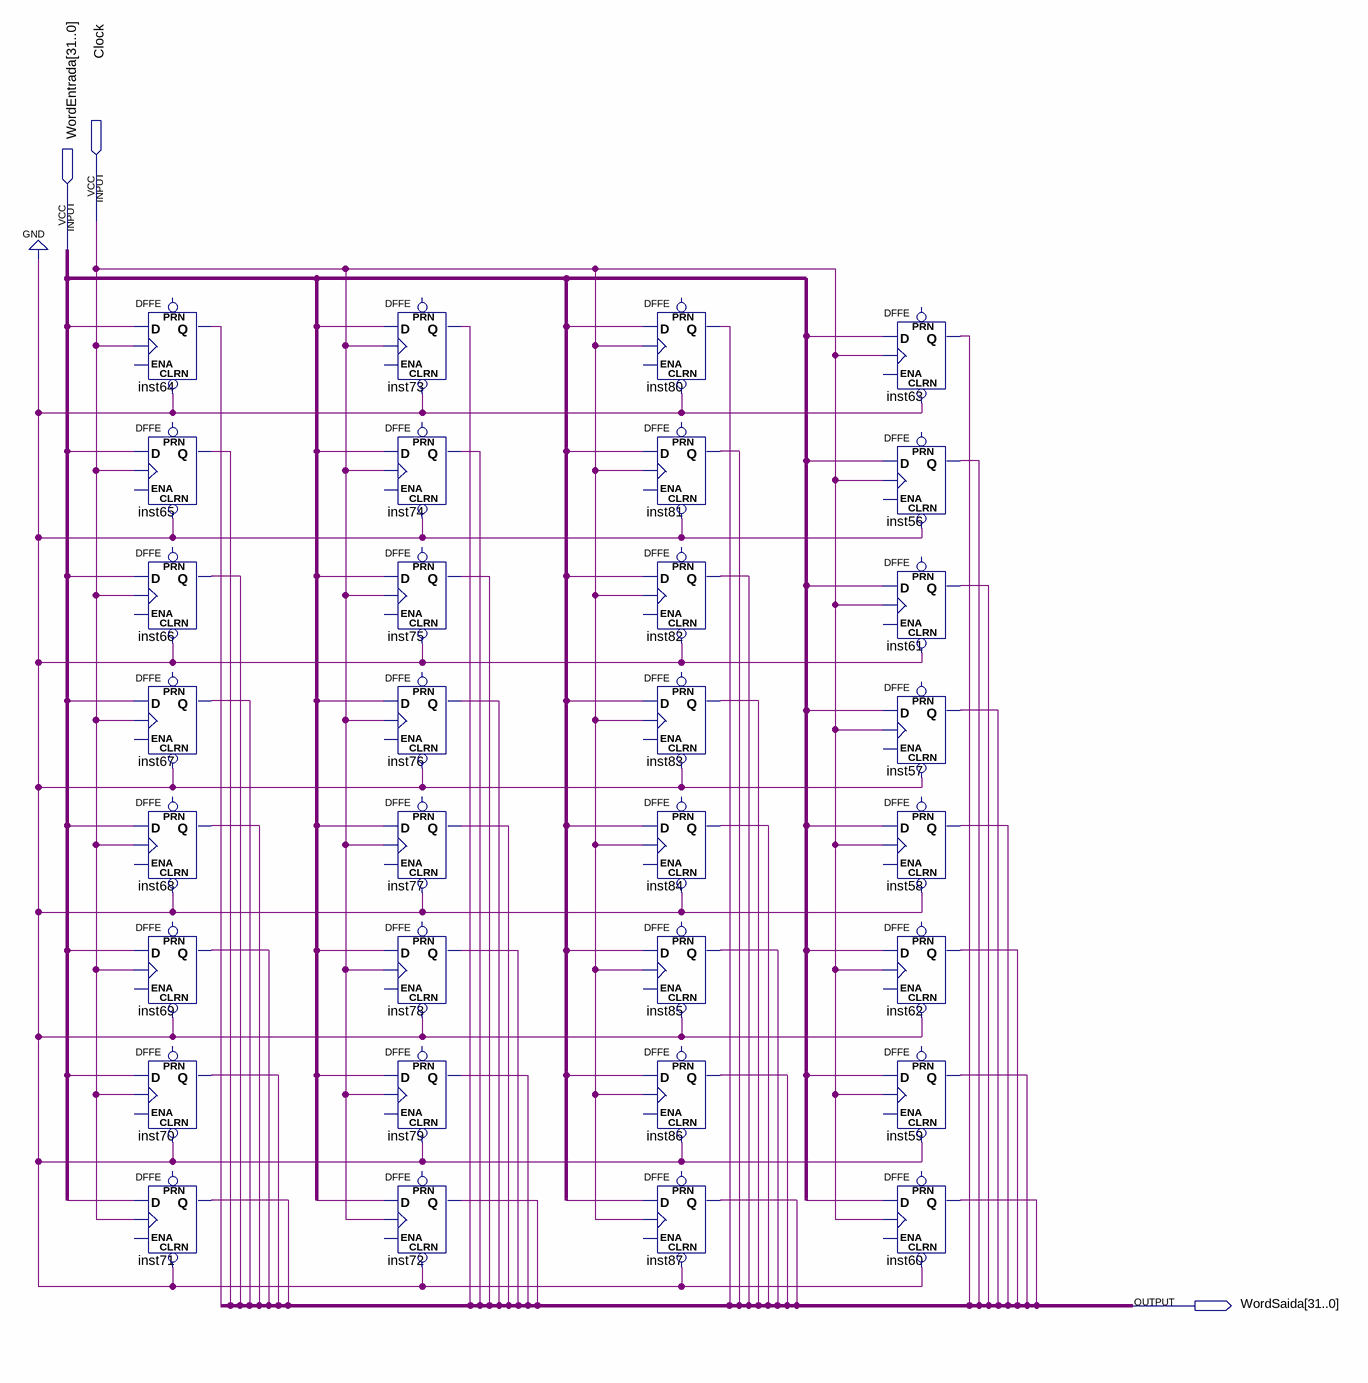
[diagram p0: schematic sheet]
// Quartus schematic RegZero.bdf as structural Verilog: 32 symbols, 3 pins
module RegZero (
  input  Clock,
  input  [31:0] WordEntrada,
  output [31:0] WordSaida
);

  DFFE inst64 (.CLRN(1'b0), .D(WordEntrada[0]), .CLK(Clock), .Q(WordSaida[0]));  // open: PRN, ENA
  DFFE inst65 (.CLRN(1'b0), .D(WordEntrada[1]), .CLK(Clock), .Q(WordSaida[1]));  // open: PRN, ENA
  DFFE inst66 (.CLRN(1'b0), .D(WordEntrada[2]), .CLK(Clock), .Q(WordSaida[2]));  // open: PRN, ENA
  DFFE inst67 (.CLRN(1'b0), .D(WordEntrada[3]), .CLK(Clock), .Q(WordSaida[3]));  // open: PRN, ENA
  DFFE inst68 (.CLRN(1'b0), .D(WordEntrada[4]), .CLK(Clock), .Q(WordSaida[4]));  // open: PRN, ENA
  DFFE inst69 (.CLRN(1'b0), .D(WordEntrada[5]), .CLK(Clock), .Q(WordSaida[5]));  // open: PRN, ENA
  DFFE inst70 (.CLRN(1'b0), .D(WordEntrada[6]), .CLK(Clock), .Q(WordSaida[6]));  // open: PRN, ENA
  DFFE inst71 (.CLRN(1'b0), .D(WordEntrada[7]), .CLK(Clock), .Q(WordSaida[7]));  // open: PRN, ENA
  DFFE inst73 (.CLRN(1'b0), .D(WordEntrada[8]), .CLK(Clock), .Q(WordSaida[8]));  // open: PRN, ENA
  DFFE inst74 (.CLRN(1'b0), .D(WordEntrada[9]), .CLK(Clock), .Q(WordSaida[9]));  // open: PRN, ENA
  DFFE inst75 (.CLRN(1'b0), .D(WordEntrada[10]), .CLK(Clock), .Q(WordSaida[10]));  // open: PRN, ENA
  DFFE inst76 (.CLRN(1'b0), .D(WordEntrada[11]), .CLK(Clock), .Q(WordSaida[11]));  // open: PRN, ENA
  DFFE inst77 (.CLRN(1'b0), .D(WordEntrada[12]), .CLK(Clock), .Q(WordSaida[12]));  // open: PRN, ENA
  DFFE inst78 (.CLRN(1'b0), .D(WordEntrada[13]), .CLK(Clock), .Q(WordSaida[13]));  // open: PRN, ENA
  DFFE inst79 (.CLRN(1'b0), .D(WordEntrada[14]), .CLK(Clock), .Q(WordSaida[14]));  // open: PRN, ENA
  DFFE inst72 (.CLRN(1'b0), .D(WordEntrada[15]), .CLK(Clock), .Q(WordSaida[15]));  // open: PRN, ENA
  DFFE inst80 (.CLRN(1'b0), .D(WordEntrada[16]), .CLK(Clock), .Q(WordSaida[16]));  // open: PRN, ENA
  DFFE inst81 (.CLRN(1'b0), .D(WordEntrada[17]), .CLK(Clock), .Q(WordSaida[17]));  // open: PRN, ENA
  DFFE inst82 (.CLRN(1'b0), .D(WordEntrada[18]), .CLK(Clock), .Q(WordSaida[18]));  // open: PRN, ENA
  DFFE inst83 (.CLRN(1'b0), .D(WordEntrada[19]), .CLK(Clock), .Q(WordSaida[19]));  // open: PRN, ENA
  DFFE inst84 (.CLRN(1'b0), .D(WordEntrada[20]), .CLK(Clock), .Q(WordSaida[20]));  // open: PRN, ENA
  DFFE inst85 (.CLRN(1'b0), .D(WordEntrada[21]), .CLK(Clock), .Q(WordSaida[21]));  // open: PRN, ENA
  DFFE inst86 (.CLRN(1'b0), .D(WordEntrada[22]), .CLK(Clock), .Q(WordSaida[22]));  // open: PRN, ENA
  DFFE inst87 (.CLRN(1'b0), .D(WordEntrada[23]), .CLK(Clock), .Q(WordSaida[23]));  // open: PRN, ENA
  DFFE inst63 (.CLRN(1'b0), .D(WordEntrada[24]), .CLK(Clock), .Q(WordSaida[24]));  // open: PRN, ENA
  DFFE inst56 (.CLRN(1'b0), .D(WordEntrada[25]), .CLK(Clock), .Q(WordSaida[25]));  // open: PRN, ENA
  DFFE inst61 (.CLRN(1'b0), .D(WordEntrada[26]), .CLK(Clock), .Q(WordSaida[26]));  // open: PRN, ENA
  DFFE inst57 (.CLRN(1'b0), .D(WordEntrada[27]), .CLK(Clock), .Q(WordSaida[27]));  // open: PRN, ENA
  DFFE inst58 (.CLRN(1'b0), .D(WordEntrada[28]), .CLK(Clock), .Q(WordSaida[28]));  // open: PRN, ENA
  DFFE inst62 (.CLRN(1'b0), .D(WordEntrada[29]), .CLK(Clock), .Q(WordSaida[29]));  // open: PRN, ENA
  DFFE inst59 (.CLRN(1'b0), .D(WordEntrada[30]), .CLK(Clock), .Q(WordSaida[30]));  // open: PRN, ENA
  DFFE inst60 (.CLRN(1'b0), .D(WordEntrada[31]), .CLK(Clock), .Q(WordSaida[31]));  // open: PRN, ENA
endmodule
